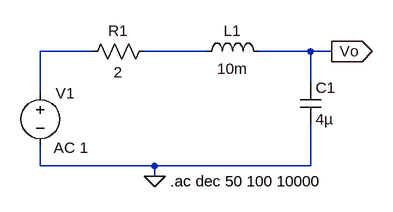
[diagram p0: schematic passive_filter_band_pass.asc]
passive_filter_band_pass.asc, the LTspice schematic file:
Version 4
SHEET 1 880 680
WIRE 80 80 0 80
WIRE 256 80 160 80
WIRE 416 80 336 80
WIRE 448 80 416 80
WIRE 416 128 416 80
WIRE 0 144 0 80
WIRE 0 256 0 224
WIRE 176 256 0 256
WIRE 416 256 416 192
WIRE 416 256 176 256
WIRE 176 272 176 256
FLAG 176 272 0
FLAG 448 80 Vo
IOPIN 448 80 Out
SYMBOL voltage 0 128 R0
WINDOW 123 21 100 Left 2
WINDOW 39 0 0 Left 2
SYMATTR Value2 AC 1
SYMATTR InstName V1
SYMATTR Value ""
SYMBOL res 64 96 R270
WINDOW 0 32 56 VTop 2
WINDOW 3 0 56 VBottom 2
SYMATTR InstName R1
SYMATTR Value 2
SYMBOL ind 240 96 R270
WINDOW 0 32 56 VTop 2
WINDOW 3 5 56 VBottom 2
SYMATTR InstName L1
SYMATTR Value 10m
SYMBOL cap 400 128 R0
SYMATTR InstName C1
SYMATTR Value 4µ
TEXT 200 280 Left 2 !.ac dec 50 100 10000

The netlist it stands for:
* passive_filter_band_pass.asc
V1 N001 0 AC 1
R1 N001 N002 2
L1 N002 Vo 10m
C1 Vo 0 4µ
.ac dec 50 100 10000
.backanno
.end